# Altium schematic sheet [2] Green activation.SchDoc
size A4; DocumentNumber: 3; SheetNumber: 3; SheetTotal: 11
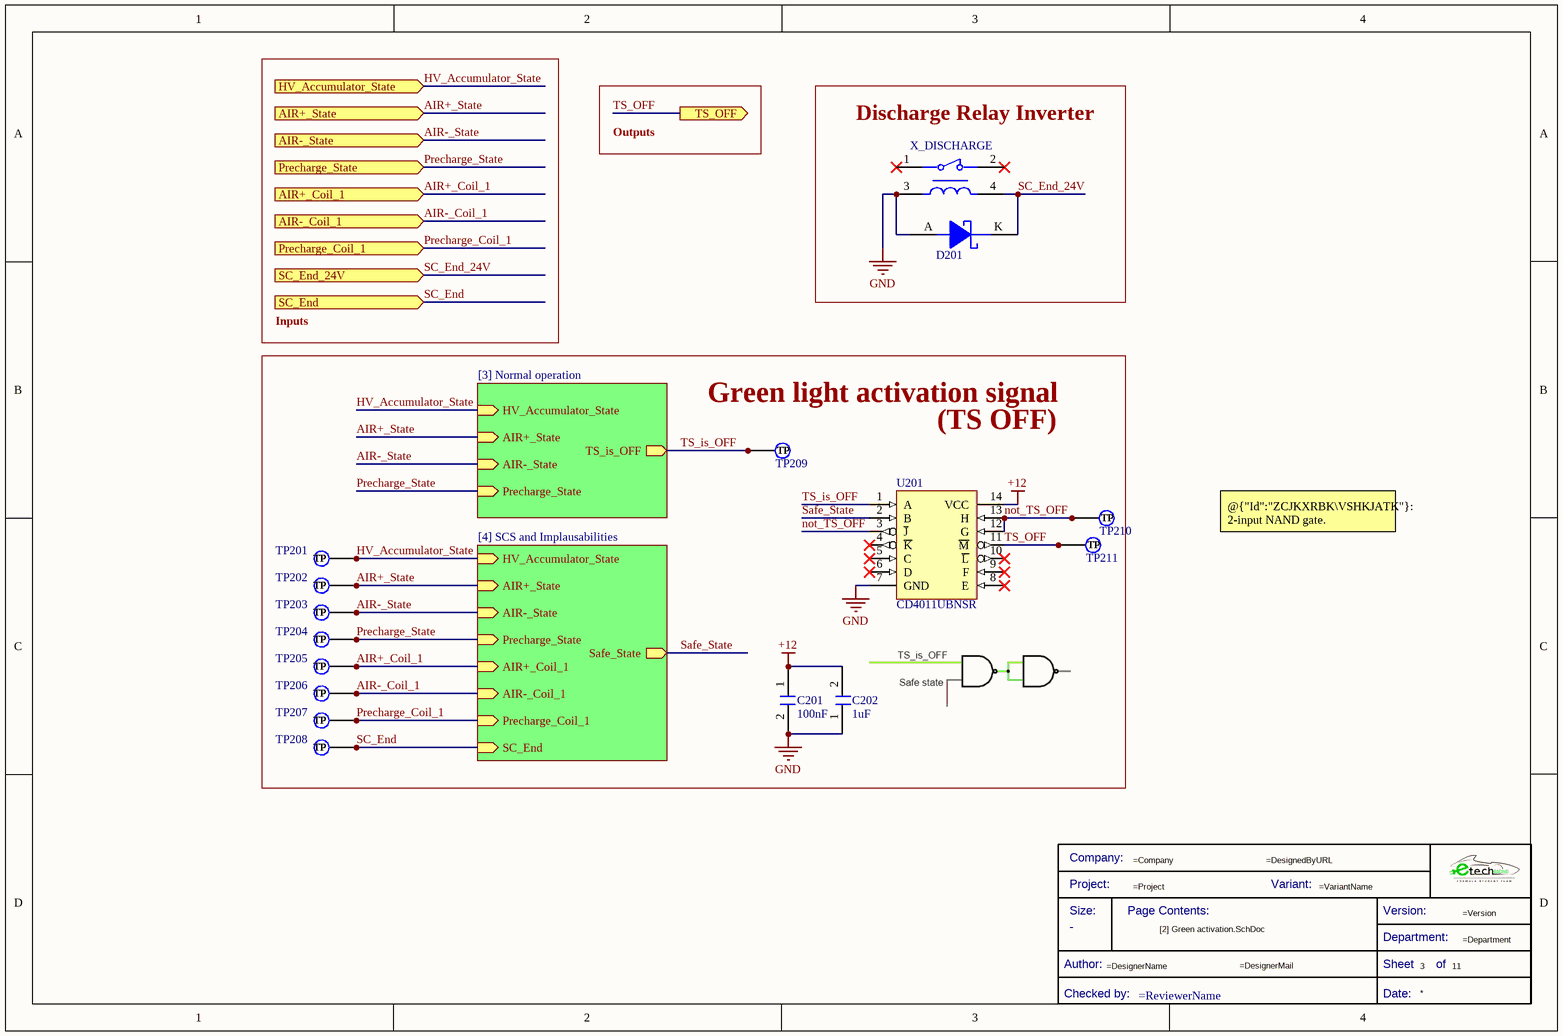
[diagram p0: [2] Green activation.SchDoc]

## Parts
*  Title Block_template  (value not drawn)  (graphical)
C201  Capacitance: 100nF  [C0805FNPC-R]  (hidden comment: 885012207098)
C202  Capacitance: 1uF  [C0805FNPC-R]  (hidden comment: 885012207103)
D201  CMDSH05-4 TR PBFREE  [DSC-0.5/40-SOD_323 - duplicate]  (value not drawn)
TP201  TestPoint  [TestPoint]  (value not drawn)  (no BOM)
TP202  TestPoint  [TestPoint]  (value not drawn)  (no BOM)
TP203  TestPoint  [TestPoint]  (value not drawn)  (no BOM)
TP204  TestPoint  [TestPoint]  (value not drawn)  (no BOM)
TP205  TestPoint  [TestPoint]  (value not drawn)  (no BOM)
TP206  TestPoint  [TestPoint]  (value not drawn)  (no BOM)
TP207  TestPoint  [TestPoint]  (value not drawn)  (no BOM)
TP208  TestPoint  [TestPoint]  (value not drawn)  (no BOM)
TP209  TestPoint  [TestPoint]  (value not drawn)  (no BOM)
TP210  TestPoint  [TestPoint]  (value not drawn)  (no BOM)
TP211  TestPoint  [TestPoint]  (value not drawn)  (no BOM)
U201  Manufacturer Part Number: CD4011UBNSR  [ARRAY_4_NAND]  (hidden comment: CD4011UBSNR)
X_DISCHARGE  DBR72410FU  [Relay_DAR72410FU]  (value not drawn)

## Blocks framed on the sheet
Discharge Relay Inverter: D201 X_DISCHARGE

## Sub-sheets
Normal operation = [3] Normal operation: HV_Accumulator_State (in), AIR+_State (in), AIR-_State (in), Precharge_State (in), TS_is_OFF (out)
SCS and Implausabilities = [4] SCS and Implausabilities: AIR+_Coil_1 (in), AIR-_Coil_1 (in), Precharge_Coil_1 (in), HV_Accumulator_State (in), AIR+_State (in), AIR-_State (in), Precharge_State (in), SC_End (in), Safe_State (out)

## Ports
AIR+_Coil_1 (in), AIR+_State (in), AIR-_Coil_1 (in), AIR-_State (in), HV_Accumulator_State (in), Precharge_Coil_1 (in), Precharge_State (in), SC_End (in), SC_End_24V (in), TS_OFF (out)

## Nets
+12: C201.1 C202.2 U201.14(VCC)
GND: C201.2 C202.1 D201.A U201.7(GND) X_DISCHARGE.3
AIR+_Coil_1: TP205.1(TP) ; port AIR+_Coil_1, sheet SCS and Implausabilities/AIR+_Coil_1
AIR+_State: TP202.1(TP) ; port AIR+_State, sheet Normal operation/AIR+_State, sheet SCS and Implausabilities/AIR+_State
AIR-_Coil_1: TP206.1(TP) ; port AIR-_Coil_1, sheet SCS and Implausabilities/AIR-_Coil_1
AIR-_State: TP203.1(TP) ; port AIR-_State, sheet Normal operation/AIR-_State, sheet SCS and Implausabilities/AIR-_State
HV_Accumulator_State: TP201.1(TP) ; port HV_Accumulator_State, sheet Normal operation/HV_Accumulator_State, sheet SCS and Implausabilities/HV_Accumulator_State
not_TS_OFF: TP210.1(TP) U201.3(~{J}) U201.12(G) U201.13(H)
Precharge_Coil_1: TP207.1(TP) ; port Precharge_Coil_1, sheet SCS and Implausabilities/Precharge_Coil_1
Precharge_State: TP204.1(TP) ; port Precharge_State, sheet Normal operation/Precharge_State, sheet SCS and Implausabilities/Precharge_State
Safe_State: U201.2(B) ; sheet SCS and Implausabilities/Safe_State
SC_End: TP208.1(TP) ; port SC_End, sheet SCS and Implausabilities/SC_End
SC_End_24V: D201.K X_DISCHARGE.4 ; port SC_End_24V
TS_is_OFF: TP209.1(TP) U201.1(A) ; sheet Normal operation/TS_is_OFF
TS_OFF: TP211.1(TP) U201.11(~{M}) ; port TS_OFF

Not connected (* = marked no-connect by the designer): U201 4(~{K})* 5(C)* 6(D)* 8(E)* 9(F)* 10(~{L})*; X_DISCHARGE 1* 2*

## Notes on the sheet
- Outputs
- Inputs
- (near TP209) Green light activation signal
- (TS OFF)
- @{"Id":"ZCJKXRBK\VSHKJATK"}: 2-input NAND gate.
- (in symbol Title Block_template) Company:; Project:; Variant:; Size:; Page Contents:; Version:; Department:; Author:; Sheet; of; Checked by:; Date:

## Library data of the parts
* = Title Block_template: Standard Title Block; .Creator: GP; Category: Title Block; .PCBcheck: GP; .SCHcheck: GP; Checked by:: =ReviewerName; Size: -
C201 = C100n-50V-0805FNPC-X7R: Cap, 0.1ΜF, 50V, 10%, X7R, 0805; Manufacturer 1: Wurth Electronics; .Creator: DR; Supplier 1: RSComponents; Manufacturer Part Number 1: 885012207098; RoHS: Yes; Category: Ceramic Capacitors; Stock 1: 8000; Pricing 1: 100=0,10200, 500=0,07100, 2000=0,06100 (GBP); Mount: Surface Mount; Case/Package: 0805; Case Code (Metric): 2012; Case Code (Imperial): 0805; Min Operating Temperature: -55°C; Max Operating Temperature: 125°C; Packaging: Cut Tape; Voltage Rating: 50V; Dielectric: X7R; Tolerance: 10%; Voltage Rating (DC): 50V; Length: 0.079inch; Width: 0.049inch; Thickness: 0.035inch; REACH SVHC: Unknown; RoHS Compliant: Yes; ComponentLink1URL: http://www.farnell.com/datasheets/1958498.pdf?src-supplier=Farnell; ComponentLink1Description: http://www.farnell.com/datasheets/1958498.pdf?src-supplier=Farnell; ComponentLink2URL: http://www.farnell.com/datasheets/1958498.pdf?src-supplier=Element14; ComponentLink2Description: http://www.farnell.com/datasheets/1958498.pdf?src-supplier=Element14; ComponentLink3URL: https://katalog.we-online.de/pbs/datasheet/885012207098.pdf?src-supplier=Digi-Key; ComponentLink3Description: https://katalog.we-online.de/pbs/datasheet/885012207098.pdf?src-supplier=Digi-Key; ComponentLink4URL: http://www.farnell.com/datasheets/1958498.pdf?src-supplier=Newark; ComponentLink4Description: http://www.farnell.com/datasheets/1958498.pdf?src-supplier=Newark; Supplier Part Number 1: 1813493
C202 = C1u-50V-0805FNPC-X7R: Multilayer Ceramic Capacitor, Wcap-Csgp Series, 1 F, 10%, X7R, 50 V, 0805 [2012 Metric] Rohs Compliant: Yes; Manufacturer 1: Wurth Electronics; Voltage Rating: 50V; .Creator: GP; Supplier 1: RSComponents; Manufacturer Part Number 1: 885012207103; RoHS: Yes; Category: Ceramic Capacitors; Stock 1: 5100; Pricing 1: 50=0,27200, 250=0,25300, 500=0,22800, 1250=0,20100, 2500=0,17100 (GBP); Mount: Surface Mount; Case/Package: 0805; Case Code (Metric): 2012; Case Code (Imperial): 0805; Min Operating Temperature: -55°C; Max Operating Temperature: 85°C; Packaging: Cut Tape; Dielectric: X7R; Tolerance: 10%; Voltage Rating (DC): 50V; Length: 0.079inch; Width: 0.049inch; Thickness: 0.053inch; REACH SVHC: Unknown; RoHS Compliant: Yes; ComponentLink1URL: http://www.farnell.com/datasheets/1958501.pdf?src-supplier=Farnell; ComponentLink1Description: http://www.farnell.com/datasheets/1958501.pdf?src-supplier=Farnell; ComponentLink2URL: http://www.farnell.com/datasheets/1958501.pdf?src-supplier=Element14; ComponentLink2Description: http://www.farnell.com/datasheets/1958501.pdf?src-supplier=Element14; ComponentLink3URL: https://katalog.we-online.de/pbs/datasheet/885012107003.pdf?src-supplier=Digi-Key; ComponentLink3Description: https://katalog.we-online.de/pbs/datasheet/885012107003.pdf?src-supplier=Digi-Key; ComponentLink4URL: http://www.farnell.com/datasheets/1958501.pdf?src-supplier=Newark; ComponentLink4Description: http://www.farnell.com/datasheets/1958501.pdf?src-supplier=Newark; Supplier Part Number 1: 1813523
D201 = DSC-0.5/40-SOD_323: CMDSH Series 40 V 500 mA Surface Mount Schottky Diode - SOD-323; Manufacturer: Central Semiconductor; Forward Voltage: 470mV; Average Rectified Current: 500mA; Peak Non-Repetitive Surge Current: 10A; Max Repetitive Reverse Voltage (Vrrm): 40V; Max Reverse Current: 100uA; Power Dissipation: 250mW; Element Configuration: Single; .Creator: GP; Category: Diode; ComponentLink1Description: Datasheet; ComponentLink1URL: https://my.centralsemi.com/datasheets/CMDSH05-4.PDF; ComponentLink2Description: Where buy it; ComponentLink2URL: https://eu.mouser.com/ProductDetail/Central-Semiconductor/CMDSH05-4-TR-PBFREE?qs=u16ybLDytRZ65hpUpJcxrg%3D%3D; Supplier 1: Digi-Key; Manufacturer Part Number: CMDSH05-4TR; RoHS: No; Pricing 1: 1=0,39000, 10=0,32000, 100=0,21790, 500=0,16342, 1000=0,12256 (USD); Mount: Surface Mount; Number of Pins: 2; Weight: 0.001164oz; Min Operating Temperature: -65°C; Max Operating Temperature: 150°C; Packaging: Tape and Reel; Termination: SMD/SMT; Forward Current: 500mA; Max Forward Surge Current (Ifsm): 10A; Max Power Dissipation: 250mW; Package Quantity: 3000; Max Reverse Voltage (DC): 40V; Series: -; Length: 1.8mm; Width: 1.35mm; Height: 1mm; Radiation Hardening: No; RoHS Compliant: No; Lead Free: Lead Free; Supplier Part Number 1: 1514-CMDSH05-4TRPBFREEDKR-ND
TP201-TP211 = TestPoint: Test Point 1x1 mm; .Creator: GP; Category: TestPoint; .PCBcheck: GP; .SCHcheck: GP
U201 = Array_4_NAND: CD4011UB Cmos Quad 2-INPUT Nand; Manufacturer: Texas Instruments; Logic Function: NAND GATE; Min Supply Voltage: 3V; Max Supply Voltage: 18V; Number of Inputs: 2; Propagation Delay: 50ns; Number of Outputs: 1; Number of Circuits: 4; Quiescent Current: 5uA; High Level Output Current: 3.4mA; Output Current: 6.8mA; Turn-On Delay Time: 120ns; .Creator: DO; Supplier 1: Digi-Key; RoHS: Yes; Category: Logic Gates; Stock 1: 964; Pricing 1: 1=0,67000, 10=0,59100, 25=0,55520, 100=0,45320, 250=0,42096, 500=0,35828, 1000=0,29575 (USD); Mount: Surface Mount; Case/Package: SOP; Number of Pins: 14; Weight: 0.007348oz; Contact Plating: Gold; Min Operating Temperature: -55°C; Max Operating Temperature: 125°C; Package Quantity: 1; Packaging: Tape and Reel; Low Level Output Current: 3.4mA; Number of Gates: 4; Number of Input Lines: 2; Number of Output Lines: 1; Number of Elements: 4; Series: 4000B; Technology: CMOS; Number of Bits: 4; Lead Free: Lead Free; RoHS Compliant: Yes; ComponentLink1URL: https://datasheet.ciiva.com/6621/cd4011ub-6621174.pdf?src-supplier=Digi-Key; ComponentLink1Description: https://datasheet.ciiva.com/6621/cd4011ub-6621174.pdf?src-supplier=Digi-Key; ComponentLink2URL: https://datasheet.ciiva.com/6621/cd4011ub-6621175.pdf?src-supplier=Digi-Key; ComponentLink2Description: https://datasheet.ciiva.com/6621/cd4011ub-6621175.pdf?src-supplier=Digi-Key; ComponentLink3URL: https://datasheet.ciiva.com/14307/cd4011ub-mil-14307943.pdf?src-supplier=Avnet; ComponentLink3Description: https://datasheet.ciiva.com/14307/cd4011ub-mil-14307943.pdf?src-supplier=Avnet; ComponentLink4URL: https://datasheet.ciiva.com/6621/cd4011ub-6621176.pdf?src-supplier=Digi-Key; ComponentLink4Description: https://datasheet.ciiva.com/6621/cd4011ub-6621176.pdf?src-supplier=Digi-Key; Supplier Part Number 1: 296-31485-1-ND; ComponentLink5Description: Where buy it; ComponentLink5URL: https://www.digikey.es/es/products/detail/texas-instruments/CD4011UBNSR/1690702?s=N4IgTCBcDaIMIBEAsAGAjGgqgIQHIGUAlAAhAF0BfIA
X_DISCHARGE = Relay_DBR72410FU: Relay, Reed Switch, SPNC, Rhodium Cntcts, 24VDC, 10kV Isol., PCB Mnt/Coil Conn./FL HV; Manufacturer: Cynergy3; Number of Poles: 1; Current Rating: 3A; Voltage Rating (DC): 24V; Coil Current: 25.9mA; Throw Configuration: SPST; Operate Time: 2ms; Release Time: 3ms; Coil Resistance: 925R; Contact Resistance: 50mR; Coil Type: Non-Latching; Life (Hours): 100000Hour; Supplier 1: Newark; Manufacturer Part Number: DBR72410F; RoHS: Yes; Category: Power Relays; Mount: Through Hole,PCB; Number of Pins: 4; Contact Material: Rhodium; Min Operating Temperature: -20°C; Max Operating Temperature: 70°C; Packaging: Tray; Package Quantity: 20; Termination: Wire Leads; Relay Type: Reed; Coil Voltage (DC): 24V; Contact Current Rating: 3A; Series: D; Length: 60mm; Height: 18.5mm; Depth: 15.8mm; RoHS Compliant: Yes; ComponentLink1URL: https://datasheet.ciiva.com/15041/dseries-15041454.pdf?src-supplier=Digi-Key; ComponentLink1Description: https://datasheet.ciiva.com/15041/dseries-15041454.pdf?src-supplier=Digi-Key; Supplier Part Number 1: 89C4343